# Altium project 基于STM32的DDS信号源的设计实例.PrjPcb
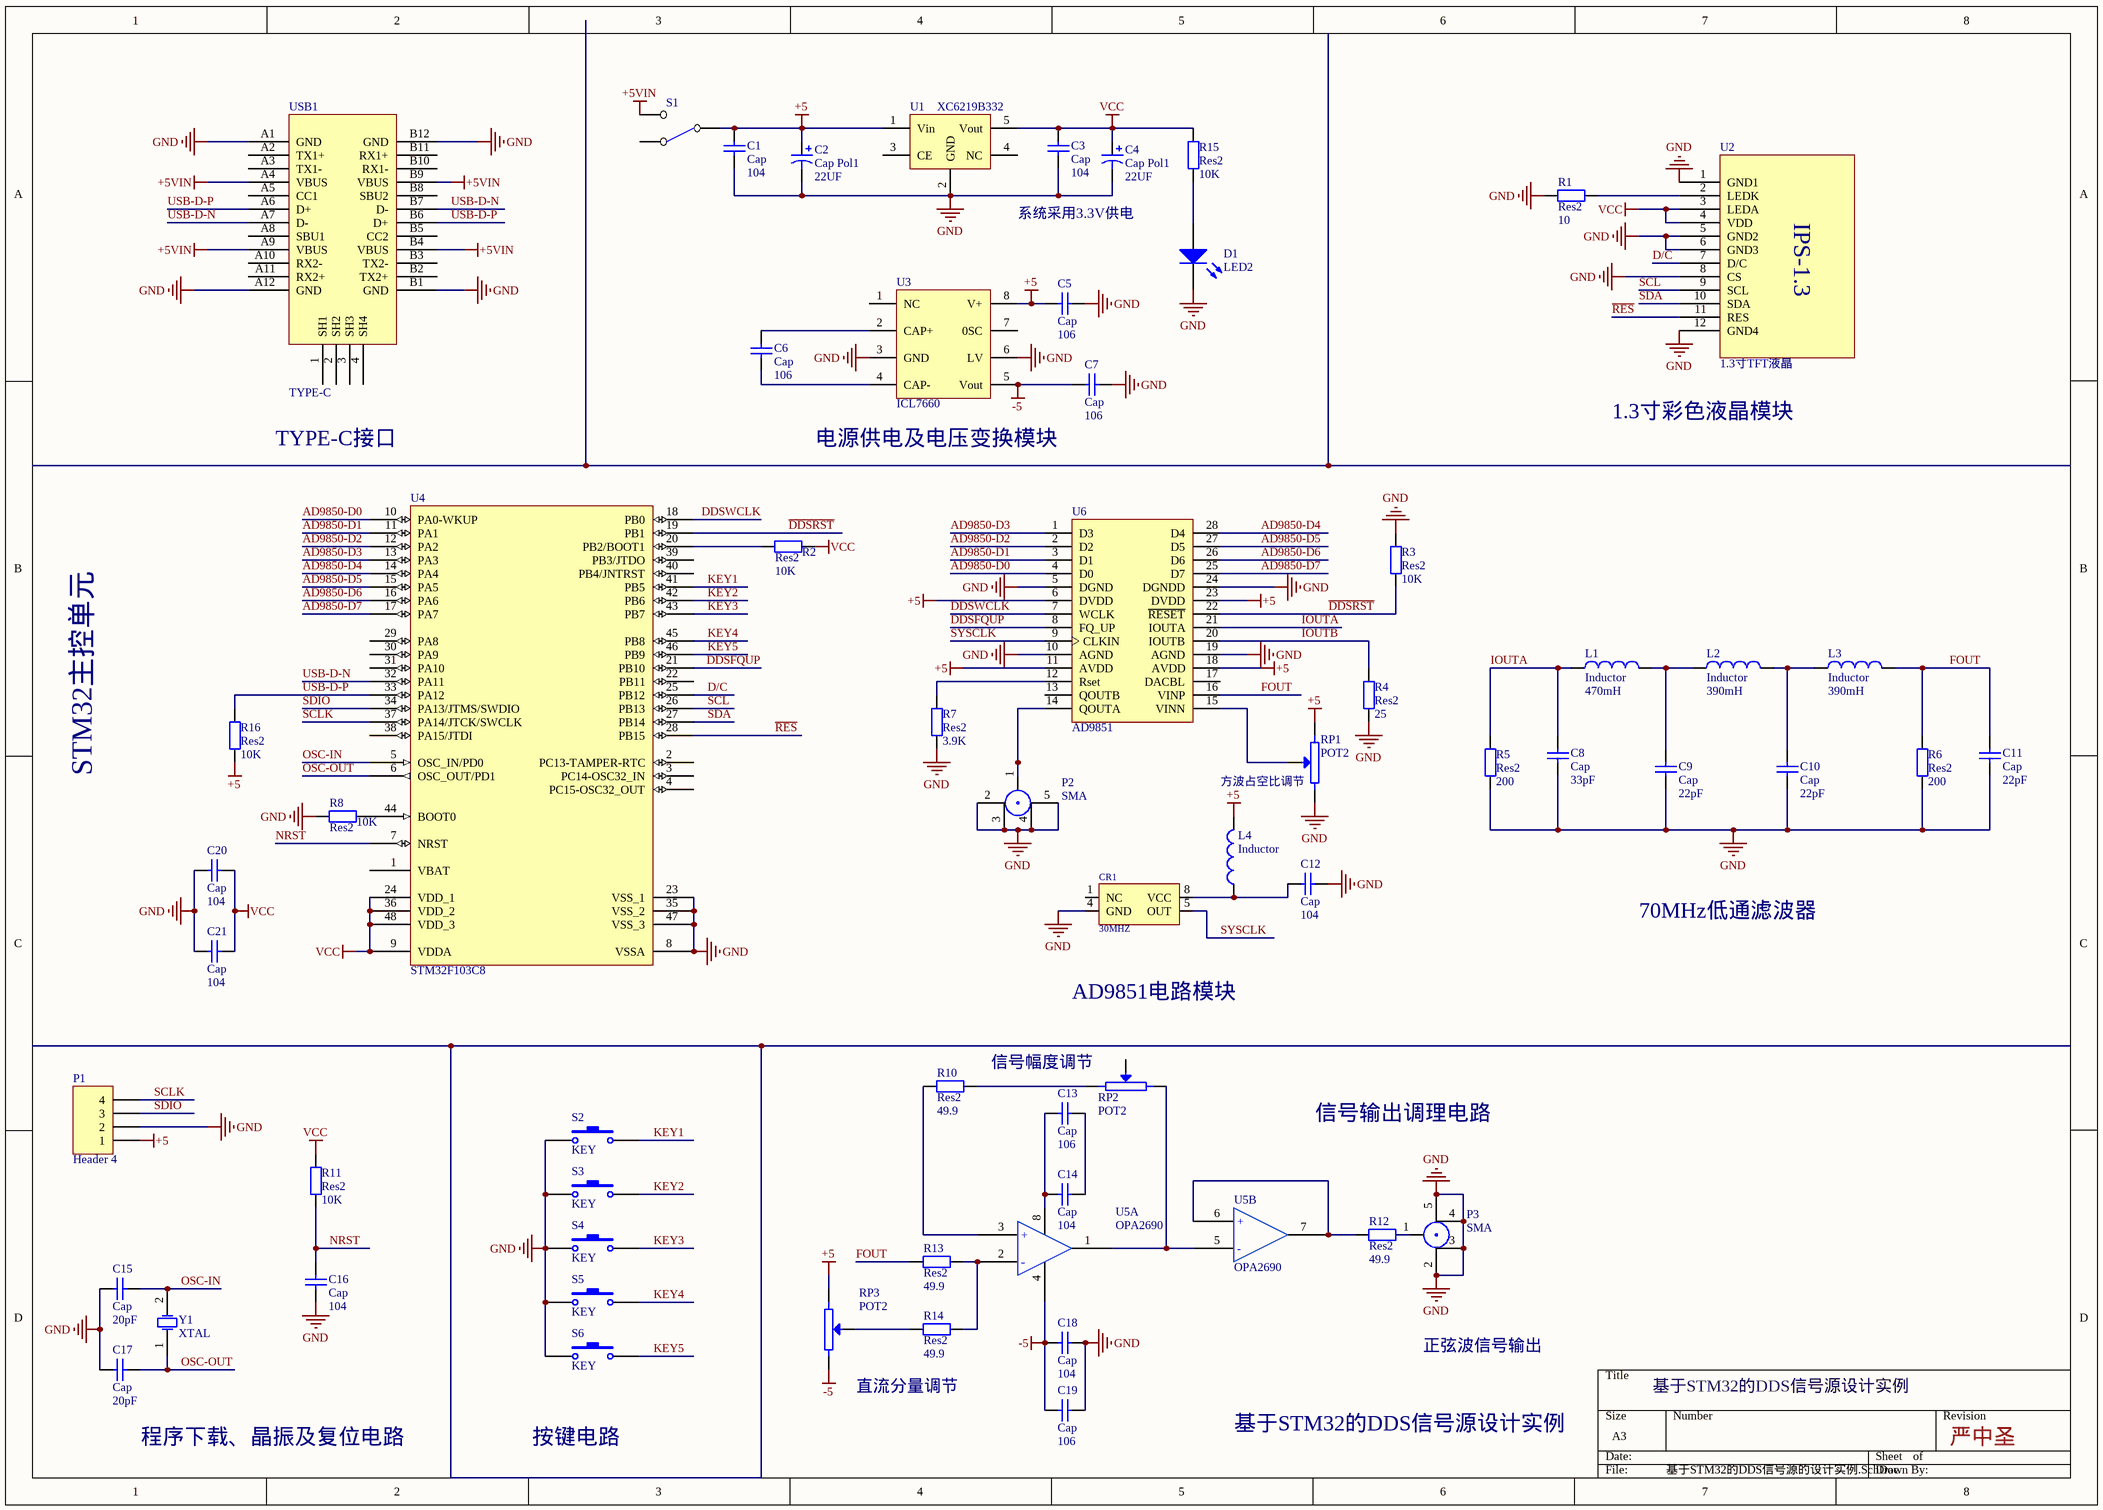
[diagram p0: 基于STM32的DDS信号源的设计实例.SchDoc]
1 sheet, 62 parts. Net scope: global (net labels, ports and power ports of the same name join across sheets).
Board file: 基于STM32的DDS信号源的设计实例.PcbDoc

## Sheet 基于STM32的DDS信号源的设计实例.SchDoc
size A3; SheetNumber: 1; SheetTotal: 1; SPICEModelCacheWTNCCPPC: <root> / <DocumentId>WTNCCPPC</DocumentId> / <CacheFrame Number="0"> / <Model Name="cap" Kind="MDL"> / <Text>*Default semiconductor capacitor / .MODEL CAP C()</Text> / </Model> / <Model Name="led2" Kind="MDL"> / <Text>*Typ RED,GREEN,YELLOW,AMBER GaAs LED: Vf=2.1V Vr=4V If=40mA trr=3uS / *LED Pinout: 1=A, 2=K / .MODEL LED2 D (IS=93.1P RS=42M N=4.61 BV=4 IBV=10U / + CJO=2.97P VJ=.75 M=.333 TT=4.32U)</Text> / </Model> / <Model Name="xtal" Kind="CKT"> / <Text>*Generic type:crystal pkg:HC33/51 / .SUBCKT XTAL 1 2 PARAMS: FREQ=1Meg RS=750 C=13pf Q=1000 / LX 1 3 {((Q*RS)/(6.2831852*FREQ))} IC=0.5M / CX 3 4 {(1/(Q*6.2831852*FREQ*RS))} / C0 1 2 {C} / RS 4 2 {RS} / .ENDS XTAL</Text> / </Model> / <Model Name="dpsw4" Kind="CKT"> / <Text>* DIP switch 4 / * jjt 20/6/2002: created / * / *             Switch connections: / *             sw1 / *             |  |  sw2 / *             |  |  |  |  sw3 / *             |  |  |  |  |  |   sw4 / *             |  |  |  |  |  |  |   | / *             |  |  |  |  |  |  |   | / .subckt dpsw4 1  2  4  5  7  8  10  11 / + PARAMS: STATE1=0 STATE2=0 STATE3=0 STATE4=0 RON=1m ROFF=100E6 / * / V1 3  0 {STATE1} / V2 6  0 {STATE2} / V3 9  0 {STATE3} / V4 12 0 {STATE4} / * / SDIP1 1  2  3  0 DIPMOD / SDIP2 4  5  6  0 DIPMOD / SDIP3 7  8  9  0 DIPMOD / SDIP4 10 11 12 0 DIPMOD / * / .MODEL DIPMOD SW(VT=0.5 RON={RON} ROFF={ROFF}) / .ends dpsw4</Text> / </Model> / <Model Name="ad645a" Kind="CKT"> / <Text>* AD645A SPICE Macro-model                  4/92, Rev. B / *                                           JCB / PMI / * / * Revision History: / *     Rev. B:  Converted model to include noise analysis. / * / * This version of the AD645 model simulates the worst case / * parameters of the 'A' grade.  The worst case parameters / * used correspond to those in the data sheet. / * / * Copyright 1990 by Analog Devices, Inc. / * / * Refer to "README.DOC" file for License Statement.  Use of this model / * indicates your acceptance with the terms and provisions in the License Statement. / * / * Node assignments / *                non-inverting input / *                |   inverting input / *                |   |   positive supply / *                |   |   |   negative supply / *                |   |   |   |   output / *                |   |   |   |   | / .SUBCKT AD645A   1   2   99  50  30 / * / * INPUT STAGE &amp; POLE AT 40 MHZ / * / R3   5  50    1.049 / R4   6  50    1.049 / CIN  1   2    1E-12 / C2   5   6    1.90E-9 / I1   99  4    100E-3 / IOS  1   2    0.5E-12 / EOS  65  1    POLY(1)  17 24  500E-6  1 / J1   5   2    4   JX / J2   6   7    4   JX / EN   7  65    43  0  1 / GN1  0   1    47  0  1E-6 / GN2  0   2    61  0  1E-6 / GB1  2  50    POLY(3) 4,2 5,2 50,2 0 1E-12 1E-12 1E-12 / GB2  7  50    POLY(3) 4,7 6,7 50,7 0 1E-12 1E-12 1E-12 / * / EREF 98  0    24  0   1 / * / * VOLTAGE NOISE GENERATOR / * / VN1  41  0    DC 2 / RS1  41 42    11.8E3 / RS2  42 43    1.2E9 / CS1  42 43    79.8E-11 / RS3  43 44    1.2E9 / CS2  43 44    79.8E-11 / RS4  44 45    11.8E3 / VN2  0  45    DC 2 / * / * CURRENT NOISE GENERATOR / * / VN3  46  0    DC 2 / RN5  46 47    144 / RN6  47 48    144 / VN4  0  48    DC 2 / * / * CURRENT NOISE GENERATOR / * / VN5  60  0    DC 2 / RN7  60 61    144 / RN8  61 62    144 / VN6  0  62    DC 2 / * / * SECOND STAGE &amp; POLE AT 3 HZ / * / R5   9  98    5.26E5 / C3   9  98    1.00E-7 / G1   98  9    5  6  9.53E-1 / V2   99  8    4.7 / V3   10 50    4.7 / D1   9   8    DX / D2   10  9    DX / * / * NEGATIVE ZERO AT 15 MHZ / * / R6   11 12     1E6 / C4   11 12     -10.6E-15 / R7   12 98     1 / E2   11 98     9  24  1E6 / * / * POLE AT 40 MHZ / * / R8   13 98     1E3 / C5   13 98     3.98E-12 / G2   98 13     12 24  1E-3 / * / * POLE AT 40 MHZ / * / R9   14 98     1E3 / C6   14 98     3.98E-12 / G3   98 14     13 24  1E-3 / * / * POLE AT 40 MHZ / * / R10  15 98     1E3 / C7   15 98     3.98E-12 / G4   98 15     14 24  1E-3 / * / * COMMON-MODE GAIN NETWORK WITH ZERO AT 600 HZ / * / R11  16 17     1E6 / C8   16 17     2.65E-10 / R12  17 98     1 / E3   16 98     POLY(2) 1  98  2  98  0  15.8  15.8 / * / * POLE AT 40 MHZ / * / R13  18 98     1E3 / C9   18 98     3.98E-12 / G5   98 18     15 24  1E-3 / * / * OUTPUT STAGE / * / R14  24 99     2000E3 / R15  24 50     2000E3 / ISY  99 50     -96.5E-3 / R16  29 99     360 / R17  29 50     360 / L1   29 30     1E-8 / G6   27 50     18 29  2.78E-3 / G7   28 50     29 18  2.78E-3 / G8   29 99     99 18  2.78E-3 / G9   50 29     18 50  2.78E-3 / V4   25 29     2.0 / V5   29 26     2.0 / D3   18 25     DX / D4   26 18     DX / D5   99 27     DX / D6   99 28     DX / D7   50 27     DY / D8   50 28     DY / F1   29  0     V4  1 / F2   0  29     V5  1 / * / * MODELS USED / * / .MODEL JX PJF(BETA=4.54  VTO=-2.000  IS=2.5E-12 RD=0.1 / + RS=0.1 CGD=1E-15 CGS=1E-15) / .MODEL DX   D(IS=1E-15 RS=10 CJO=1E-15) / .MODEL DY   D(IS=1E-15 BV=50 RS=10 CJO=1E-15) / .MODEL DEN  D(IS=1E-12 RS=7409.6 KF=2.051E-15 AF=1) / .MODEL DIN  D(IS=1E-12 RS=41.5 KF=0 AF=1) / .ENDS AD645A</Text> / </Model> / </CacheFrame> / </root>

### Parts
C1  Cap  value 104  [RAD-0.3]
C2  Cap Pol1  value 22UF  [RB7.6-15]
C3  Cap  value 104  [RAD-0.3]
C4  Cap Pol1  value 22UF  [RB7.6-15]
C5  Cap  value 106  [RAD-0.3]
C6  Cap  value 106  [RAD-0.3]
C7  Cap  value 106  [RAD-0.3]
C8  Cap  value 33pF  [RAD-0.3]
C9  Cap  value 22pF  [RAD-0.3]
C10  Cap  value 22pF  [RAD-0.3]
C11  Cap  value 22pF  [RAD-0.3]
C12  Cap  value 104  [RAD-0.3]
C13  Cap  value 106  [RAD-0.3]
C14  Cap  value 104  [RAD-0.3]
C15  Cap  value 20pF  [RAD-0.3]
C16  Cap  value 104  [RAD-0.3]
C17  Cap  value 20pF  [RAD-0.3]
C18  Cap  value 104  [RAD-0.3]
C19  Cap  value 106  [RAD-0.3]
C20  Cap  value 104  [RAD-0.3]
C21  Cap  value 104  [RAD-0.3]
CR1  30MHZ  [CRYSTAL-SMT-5X7]
D1  LED2  [3.2X1.6X1.1]
L1  Inductor  value 470mH  [0402-A]
L2  Inductor  value 390mH  [0402-A]
L3  Inductor  value 390mH  [0402-A]
L4  Inductor  [6-0805_N]
P1  Header 4  [HDR1X4]
P2  SMA  [SMA-KE]
P3  SMA  [SMA-KE]
R1  Res2  value 10  [AXIAL-0.4]
R2  Res2  value 10K  [AXIAL-0.4]
R3  Res2  value 10K  [AXIAL-0.4]
R4  Res2  value 25  [AXIAL-0.4]
R5  Res2  value 200  [AXIAL-0.4]
R6  Res2  value 200  [AXIAL-0.4]
R7  Res2  value 3.9K  [AXIAL-0.4]
R8  Res2  value 10K  [AXIAL-0.4]
R10  Res2  value 49.9  [AXIAL-0.4]
R11  Res2  value 10K  [AXIAL-0.4]
R12  Res2  value 49.9  [AXIAL-0.4]
R13  Res2  value 49.9  [AXIAL-0.4]
R14  Res2  value 49.9  [AXIAL-0.4]
R15  Res2  value 10K  [AXIAL-0.4]
R16  Res2  value 10K  [AXIAL-0.4]
RP1  POT2  [VR7]
RP2  POT2  [VR7]
RP3  POT2  [VR7]
S1  (no value)  [SW-SPDT-7P]
S2  KEY  [SW-MINI]
S3  KEY  [SW-MINI]
S4  KEY  [SW-MINI]
S5  KEY  [SW-MINI]
S6  KEY  [SW-MINI]
U1  XC6219B332  [SOT23-5L]
U2  1.3寸TFT液晶  [1.3-TFT-TPS]
U3  ICL7660  [SO-8]
U4  STM32F103C8  [TQFP-48]
U5  OPA2690  [SO-8]  (parts A,B of 2)
U6  AD9851  [TSSOP28]
USB1  TYPE-C  [TYPE-C]
Y1  XTAL  [R38]

### Nets
+5: C1.2 C2.1 C5.1 L4.2 P1.1 R16.1 RP1.2 RP3.1 S1.2(COMMON) U1.1(Vin) U3.8(V+) U6.6(DVDD) U6.11(AVDD) U6.18(AVDD) U6.23(DVDD)
+5VIN: S1.3(NO) USB1.A4(VBUS) USB1.A9(VBUS) USB1.B4(VBUS) USB1.B9(VBUS)
-5: C7.1 C18.2 C19.2 RP3.2 U3.5(Vout) U5.4
GND: C1.1 C2.2 C3.1 C4.2 C5.2 C7.2 C8.1 C9.1 C10.1 C11.1 C12.2 C15.1 C16.1 C17.1 C18.1 C19.1 C20.1 C21.1 CR1.4(GND) D1.2(K) P1.2 P2.2 P2.3 P2.4 P2.5 P3.2 P3.3 P3.4 P3.5 R1.1 R3.2 R4.1 R5.1 R6.1 R7.1 R8.1 RP1.1 S2.1 S3.1 S4.1 S5.1 S6.1 U1.2(GND) U2.1(GND1) U2.5(GND2) U2.6(GND3) U2.8(CS) U2.12(GND4) U3.3(GND) U3.6(LV) U4.8(VSSA) U4.23(VSS_1) U4.35(VSS_2) U4.47(VSS_3) U6.5(DGND) U6.10(AGND) U6.19(AGND) U6.24(DGNDD) USB1.A1(GND) USB1.A12(GND) USB1.B1(GND) USB1.B12(GND)
VCC: C3.2 C4.1 C20.2 C21.2 R2.2 R11.2 R15.2 U1.5(Vout) U2.3(LEDA) U2.4(VDD) U4.9(VDDA) U4.24(VDD_1) U4.36(VDD_2) U4.48(VDD_3)
AD9850-D0: U4.10(PA0-WKUP) U6.4(D0)
AD9850-D1: U4.11(PA1) U6.3(D1)
AD9850-D2: U4.12(PA2) U6.2(D2)
AD9850-D3: U4.13(PA3) U6.1(D3)
AD9850-D4: U4.14(PA4) U6.28(D4)
AD9850-D5: U4.15(PA5) U6.27(D5)
AD9850-D6: U4.16(PA6) U6.26(D6)
AD9850-D7: U4.17(PA7) U6.25(D7)
D/C: U2.7(D/C) U4.25(PB12)
~{DDSRST}: R3.1 U4.19(PB1) U6.22(~{RESET})
DDSFQUP: U4.21(PB10) U6.8(FQ_UP)
DDSWCLK: U4.18(PB0) U6.7(WCLK)
FOUT: C11.2 L3.2 R6.2 R13.1 U6.16(VINP)
IOUTA: C8.2 L1.1 R5.2 U6.21(IOUTA)
IOUTB: R4.2 U6.20(IOUTB)
KEY1: S2.2 U4.41(PB5)
KEY2: S3.2 U4.42(PB6)
KEY3: S4.2 U4.43(PB7)
KEY4: S5.2 U4.45(PB8)
KEY5: S6.2 U4.46(PB9)
NRST: C16.2 R11.1 U4.7(NRST)
OSC-IN: C15.2 U4.5(OSC_IN/PD0) Y1.2(OSC2)
OSC-OUT: C17.2 U4.6(OSC_OUT/PD1) Y1.1(OSC1)
~{RES}: U2.11(RES) U4.28(PB15)
SCL: U2.9(SCL) U4.26(PB13)
SCLK: P1.4 U4.37(PA14/JTCK/SWCLK)
SDA: U2.10(SDA) U4.27(PB14)
SDIO: P1.3 U4.34(PA13/JTMS/SWDIO)
SYSCLK: CR1.5(OUT) U6.9(CLKIN)
USB-D-N: U4.32(PA11) USB1.A7(D-) USB1.B7(D-)
USB-D-P: R16.2 U4.33(PA12) USB1.A6(D+) USB1.B6(D+)
NetC6_1: C6.1 U3.2(CAP+)
NetC6_2: C6.2 U3.4(CAP-)
NetC9_2: C9.2 L1.2 L2.1
NetC10_2: C10.2 L2.2 L3.1
NetC12_1: C12.1 CR1.8(VCC) L4.1
NetC13_1: C13.1 C14.1
NetC13_2: C13.2 C14.2 U5.8
NetD1_1: D1.1(A) R15.1
NetP2_1: P2.1 U6.14(QOUTA)
NetP3_1: P3.1 R12.2
NetR1_2: R1.2 U2.2(LEDK)
NetR2_1: R2.1 U4.20(PB2/BOOT1)
NetR7_2: R7.2 U6.12(Rset)
NetR8_2: R8.2 U4.44(BOOT0)
NetR10_1: R10.1 U5.3(+)
NetR10_2: R10.2 RP2.1
NetR12_1: R12.1 U5.6(+) U5.7
NetR13_2: R13.2 R14.2 U5.2(-)
NetR14_1: R14.1 RP3.3
NetRP1_3: RP1.3 U6.15(VINN)
NetRP2_2: RP2.2 U5.1 U5.5(-)

Not connected (* = marked no-connect by the designer): CR1 1(NC); RP2 3; S1 1(NC); U1 3(CE) 4(NC); U3 1(NC) 7(0SC); U4 1(VBAT) 2(PC13-TAMPER-RTC) 3(PC14-OSC32_IN) 4(PC15-OSC32_OUT) 22(PB11) 29(PA8) 30(PA9) 31(PA10) 38(PA15/JTDI) 39(PB3/JTDO) 40(PB4/JNTRST); U6 13(QOUTB) 17(DACBL); USB1 1(SH1) 2(SH2) 3(SH3) 4(SH4) A2(TX1+) A3(TX1-) A5(CC1) A8(SBU1) A10(RX2-) A11(RX2+) B2(TX2+) B3(TX2-) B5(CC2) B8(SBU2) B10(RX1-) B11(RX1+)

### Notes on the sheet
- 系统采用3.3V供电
- TYPE-C接口
- (near U3) 电源供电及电压变换模块
- 1.3寸彩色液晶模块
- STM32主控单元
- 方波占空比调节
- 70MHz低通滤波器
- AD9851电路模块
- 信号幅度调节
- 信号输出调理电路
- (near RP3) 直流分量调节
- 正弦波信号输出
- 基于STM32的DDS信号源设计实例
- 程序下载、晶振及复位电路
- 按键电路
- 严中圣
- (in symbol 1.3寸TFT液晶) IPS-1.3

### Library data of the parts
C1 C3 C5-C21 = Cap: Capacitor; Published: 8-Jun-2000; LatestRevisionDate: 17-Jul-2002; LatestRevisionNote: Re-released for DXP Platform.; PackageReference: RAD-0.3; Publisher: Altium Limited; PackageDescription: Radial Cap, Thru-Hole; 2 Leads; 0.3 in Pin Spacing
C2 C4 = Cap Pol1: Polarized Capacitor (Radial); Published: 8-Jun-2000; LatestRevisionDate: 17-Jul-2002; LatestRevisionNote: Re-released for DXP Platform.; PackageReference: RB7.6-15; Publisher: Altium Limited; PackageDescription: Polarized Capacitor (Radial); 2 Leads
CR1 = CRYSTAL-DIP8
D1 = LED2: Typical RED, GREEN, YELLOW, AMBER GaAs LED; Published: 8-Jun-2000; LatestRevisionDate: 17-Jul-2002; LatestRevisionNote: Re-released for DXP Platform.; PackageVersion: Feb-2002; PackageReference: 3.2X1.6X1.1; Publisher: Altium Limited; PackageDescription: SM LED; 2 Flat Leads
L1-L4 = Inductor: Code_IEC: 1005; Published: 8-Jun-2000; LatestRevisionDate: 29-May-2009; LatestRevisionNote: IPC-7351 Footprint Added.; PackageReference: 0402-A; Publisher: Altium Limited; PackageDescription: Chip Inductor; Code_JEITA: 0402
P1 = Header 4: Header, 4-Pin; LatestRevisionDate: 17-Jul-2002; LatestRevisionNote: Re-released for DXP Platform.; Publisher: Altium Limited
R1-R8 R10-R16 = Res2: Resistor; Published: 8-Jun-2000; LatestRevisionDate: 17-Jul-2002; LatestRevisionNote: Re-released for DXP Platform.; PackageReference: AXIAL-0.4; Publisher: Altium Limited; PackageDescription: Axial Device, Thru-Hole; 2 Leads; 0.4 in Pin Spacing
RP1-RP3 = POT2: Potentiometer
S1 = SW SPDT
S2-S6 = SW-PB: Switch; Published: 24-Mar-1999; LatestRevisionDate: 17-Jul-2002; LatestRevisionNote: Re-released for DXP Platform.; PackageReference: SPST-2; Publisher: Altium Limited; PackageDescription: Switch; 2 Leads
U1 = XC6219
U4 = STM32F103C8: Flaah:64/RAM:20/IO:36; BOM名称: 32位STM单片机; 版权归属: 源创客; 学习资源: www.ooocke.com
Y1 = XTAL: Crystal Oscillator; Published: 8-Jun-2000; LatestRevisionDate: 17-Jul-2002; LatestRevisionNote: Re-released for DXP Platform.; PackageReference: R38; Publisher: Altium Limited; PackageDescription: Crystal, Thru-Hole; 2 Leads; Body 3.1 x 8.2 mm (Dia.xH)